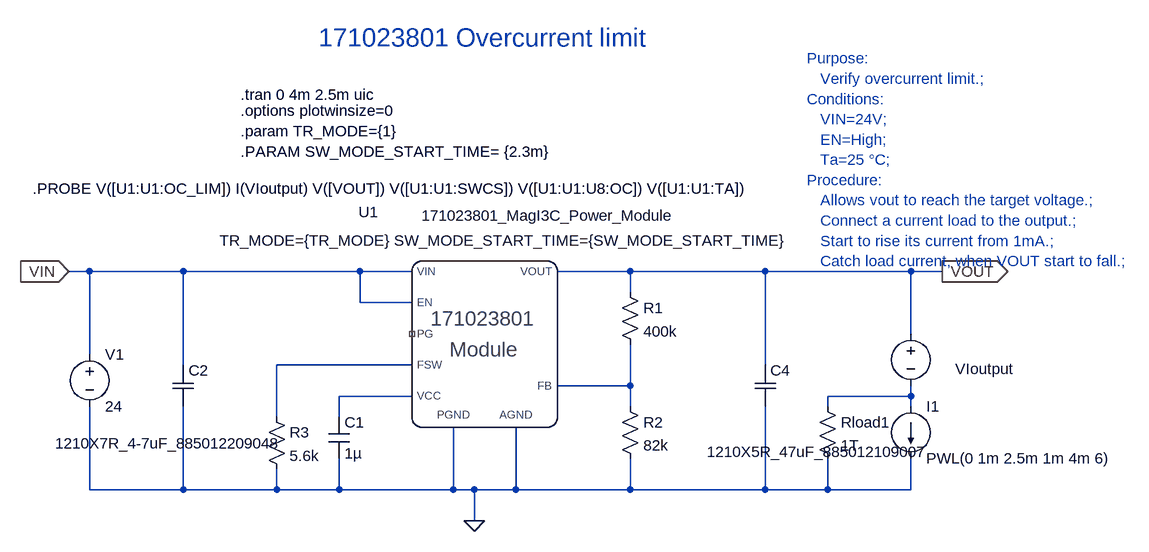
[diagram p0: schematic 171023801 Overcurrent limit.asc]
171023801 Overcurrent limit.asc, the LTspice schematic file:
Version 4
SHEET 1 1600 680
WIRE -384 48 -416 48
WIRE -240 48 -384 48
WIRE 32 48 -240 48
WIRE 112 48 32 48
WIRE 448 48 336 48
WIRE 656 48 448 48
WIRE 880 48 656 48
WIRE 928 48 880 48
WIRE 448 80 448 48
WIRE 32 96 32 48
WIRE 112 96 32 96
WIRE 880 144 880 48
WIRE -384 176 -384 48
WIRE -240 192 -240 48
WIRE 112 192 -96 192
WIRE 656 192 656 48
WIRE 448 224 448 160
WIRE 448 224 336 224
WIRE 112 240 0 240
WIRE 880 240 880 224
WIRE 880 240 752 240
WIRE 448 256 448 224
WIRE 752 256 752 240
WIRE 880 256 880 240
WIRE -96 272 -96 192
WIRE 0 272 0 240
WIRE -384 384 -384 256
WIRE -240 384 -240 256
WIRE -240 384 -384 384
WIRE -96 384 -96 352
WIRE -96 384 -240 384
WIRE 0 384 0 336
WIRE 0 384 -96 384
WIRE 176 384 176 288
WIRE 176 384 0 384
WIRE 208 384 176 384
WIRE 272 384 272 288
WIRE 272 384 208 384
WIRE 448 384 448 336
WIRE 448 384 272 384
WIRE 656 384 656 256
WIRE 656 384 448 384
WIRE 752 384 752 336
WIRE 752 384 656 384
WIRE 880 384 880 336
WIRE 880 384 752 384
WIRE 208 432 208 384
FLAG 208 432 0
FLAG -416 48 VIN
IOPIN -416 48 In
FLAG 928 48 VOUT
IOPIN 928 48 Out
SYMBOL res 432 64 R0
SYMATTR InstName R1
SYMATTR Value 400k
SYMBOL res 432 240 R0
SYMATTR InstName R2
SYMATTR Value 82k
SYMBOL res -112 256 R0
SYMATTR InstName R3
SYMATTR Value 5.6k
SYMBOL cap -16 272 R0
SYMATTR InstName C1
SYMATTR Value 1µ
SYMATTR SpiceLine Rser=7.13m Lser=257p
SYMBOL voltage -384 160 R0
WINDOW 123 0 0 Left 0
WINDOW 39 0 0 Left 0
SYMATTR InstName V1
SYMATTR Value 24
SYMBOL current 880 256 R0
WINDOW 123 24 108 Left 2
WINDOW 39 0 0 Left 0
SYMATTR InstName I1
SYMATTR Value PWL(0 1m 2.5m 1m 4m 6)
SYMBOL voltage 880 128 R0
WINDOW 123 0 0 Left 0
WINDOW 39 24 124 Left 2
WINDOW 0 158 70 Right 2
SYMATTR InstName VIoutput
SYMATTR Value ""
SYMBOL res 736 240 R0
SYMATTR InstName Rload1
SYMATTR Value 1T
SYMBOL WCAP-CSGP_10V_DCbias 640 192 R0
WINDOW 38 -74 134 Left 2
SYMATTR SpiceModel 1210X5R_47uF_885012109007
SYMATTR InstName C4
SYMBOL WCAP-CSGP_50V_DCbias -256 192 R0
WINDOW 38 -181 121 Left 2
SYMATTR SpiceModel 1210X7R_4-7uF_885012209048
SYMATTR InstName C2
SYMBOL 171023801_MagI3C_Power_Module 256 64 R0
SYMATTR InstName U1
TEXT -32 -312 Left 4 ;171023801 Overcurrent limit
TEXT 720 -280 Left 2 ;Purpose: \n   Verify overcurrent limit.; \nConditions: \n   VIN=24V; \n   EN=High; \n   Ta=25 °C; \nProcedure: \n   Allows vout to reach the target voltage.; \n   Connect a current load to the output.; \n   Start to rise its current from 1mA.; \n   Catch load current, when VOUT start to fall.;
TEXT -152 -224 Left 2 !.tran 0 4m 2.5m uic
TEXT -152 -200 Left 2 !.options plotwinsize=0
TEXT -152 -168 Left 2 !.param TR_MODE={1}\n.PARAM SW_MODE_START_TIME= {2.3m}
TEXT -472 -80 Left 2 !.PROBE V([U1:U1:OC_LIM]) I(VIoutput) V([VOUT]) V([U1:U1:SWCS]) V([U1:U1:U8:OC]) V([U1:U1:TA])

The netlist it stands for:
* 171023801 Overcurrent limit.asc
R1 VOUT N002 400k
R2 N002 0 82k
R3 N001 0 5.6k
C1 N003 0 1µ Rser=7.13m Lser=257p
V1 VIN 0 24
I1 N004 0 PWL(0 1m 2.5m 1m 4m 6)
VIoutput VOUT N004
Rload1 N004 0 1T
XC4 VOUT 0 1210X5R_47uF_885012109007  ; pins A B
XC2 VIN 0 1210X7R_4-7uF_885012209048  ; pins A B
XU1 VOUT N002 VIN VIN NC_01 N001 N003 0 0 171023801_MagI3C_Power_Module TR_MODE={TR_MODE} SW_MODE_START_TIME={SW_MODE_START_TIME}  ; pins VOUT FB VIN EN PG FSW VCC PGND AGND
* 171023801 Overcurrent limit
* Purpose:
*    Verify overcurrent limit.;
* Conditions:
*    VIN=24V;
*    EN=High;
*    Ta=25 °C;
* Procedure:
*    Allows vout to reach the target voltage.;
*    Connect a current load to the output.;
*    Start to rise its current from 1mA.;
*    Catch load current, when VOUT start to fall.;
.tran 0 4m 2.5m uic
.options plotwinsize=0
.param TR_MODE={1}
.PARAM SW_MODE_START_TIME= {2.3m}
.PROBE V([U1:U1:OC_LIM]) I(VIoutput) V([VOUT]) V([U1:U1:SWCS]) V([U1:U1:U8:OC]) V([U1:U1:TA])
.lib WCAP-CSGP_10V_DCbias.lib
.lib WCAP-CSGP_50V_DCbias.lib
.lib 171023801.lib
.backanno
.end